# Altium schematic sheet FPGA_E.SchDoc: FIT_PM12 board
size 420 x 297 mm; CheckedBy: G.Kasprowicz; Author: INR Moscow; CompanyName: WUT ISE; DrawnBy: M.Podgórski; Organization: WUT ISE; Address1: PW ISE; Address2: Nowowiejska 15/19 00-665 Warsaw; Address3: gkasprow@gmail.com; DocumentNumber: 27; Revision: 2; SheetNumber: 25; SheetTotal: 34; ModifiedBy: -; CheckedDate: -; Title2: FPGA E LA0,1,2; DivGrp: WUT ISE; Designer: INR RAS; ModifiedDate: -; ProjectName: Sensor Box
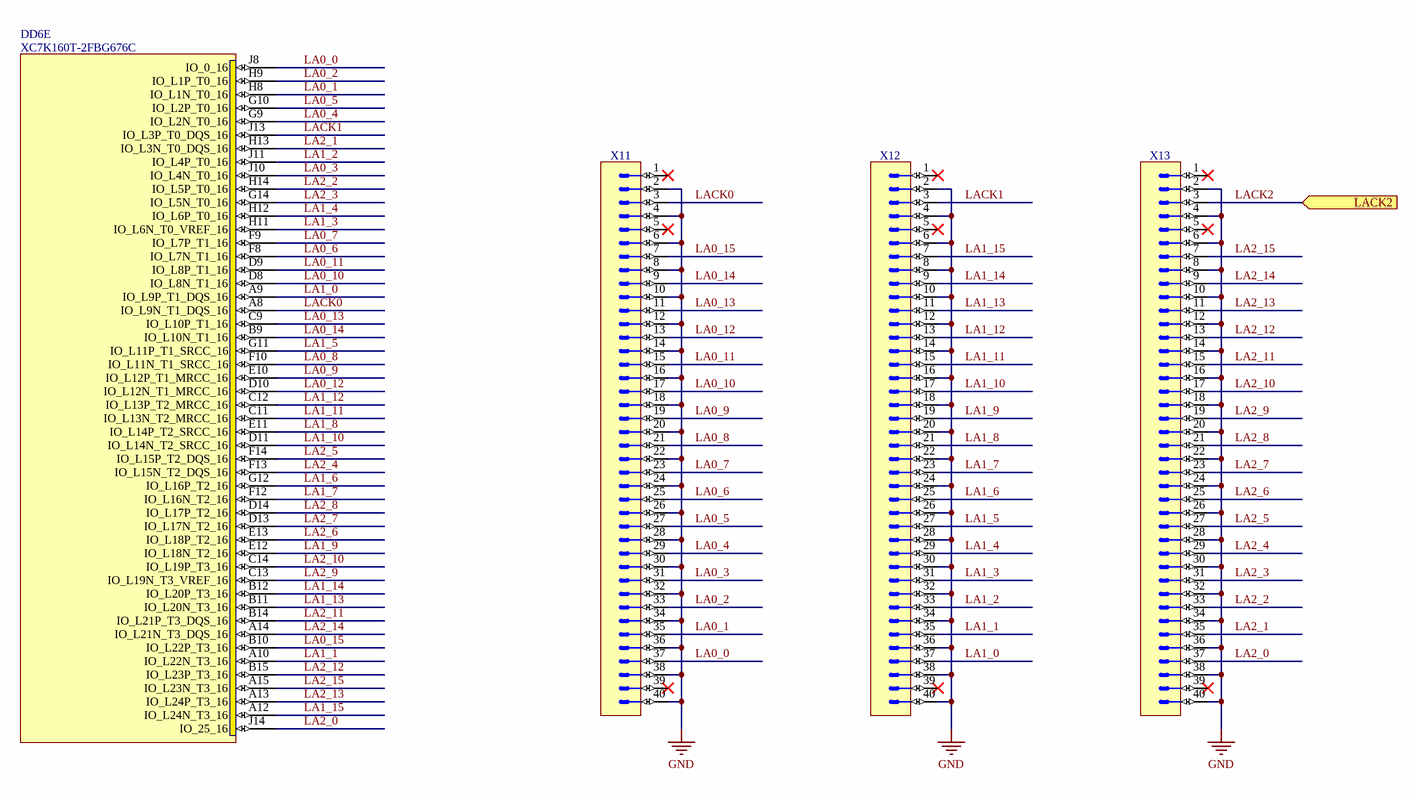
[diagram p0: FPGA_E.SchDoc]

## Parts
DD6  XC7K160T-2FBG676C  [BGA676C100P26X26_2700X2700X254]  (part E of 15)
X11  (no value)  [CONNFLY_DS1013-40SSIB1-B-0]
X12  (no value)  [CONNFLY_DS1013-40SSIB1-B-0]
X13  (no value)  [CONNFLY_DS1013-40SSIB1-B-0]

## Ports
LACK2 (in)

## Nets
GND: X11.2 X11.4 X11.6 X11.8 X11.10 X11.12 X11.14 X11.16 X11.18 X11.20 X11.22 X11.24 X11.26 X11.28 X11.30 X11.32 X11.34 X11.36 X11.38 X11.40 X12.2 X12.4 X12.6 X12.8 X12.10 X12.12 X12.14 X12.16 X12.18 X12.20 X12.22 X12.24 X12.26 X12.28 X12.30 X12.32 X12.34 X12.36 X12.38 X12.40 X13.2 X13.4 X13.6 X13.8 X13.10 X13.12 X13.14 X13.16 X13.18 X13.20 X13.22 X13.24 X13.26 X13.28 X13.30 X13.32 X13.34 X13.36 X13.38 X13.40
LA0_0: DD6.J8(IO_0_16) X11.37
LA0_1: DD6.H8(IO_L1N_T0_16) X11.35
LA0_2: DD6.H9(IO_L1P_T0_16) X11.33
LA0_3: DD6.J10(IO_L4N_T0_16) X11.31
LA0_4: DD6.G9(IO_L2N_T0_16) X11.29
LA0_5: DD6.G10(IO_L2P_T0_16) X11.27
LA0_6: DD6.F8(IO_L7N_T1_16) X11.25
LA0_7: DD6.F9(IO_L7P_T1_16) X11.23
LA0_8: DD6.F10(IO_L11N_T1_SRCC_16) X11.21
LA0_9: DD6.E10(IO_L12P_T1_MRCC_16) X11.19
LA0_10: DD6.D8(IO_L8N_T1_16) X11.17
LA0_11: DD6.D9(IO_L8P_T1_16) X11.15
LA0_12: DD6.D10(IO_L12N_T1_MRCC_16) X11.13
LA0_13: DD6.C9(IO_L10P_T1_16) X11.11
LA0_14: DD6.B9(IO_L10N_T1_16) X11.9
LA0_15: DD6.B10(IO_L22P_T3_16) X11.7
LA1_0: DD6.A9(IO_L9P_T1_DQS_16) X12.37
LA1_1: DD6.A10(IO_L22N_T3_16) X12.35
LA1_2: DD6.J11(IO_L4P_T0_16) X12.33
LA1_3: DD6.H11(IO_L6N_T0_VREF_16) X12.31
LA1_4: DD6.H12(IO_L6P_T0_16) X12.29
LA1_5: DD6.G11(IO_L11P_T1_SRCC_16) X12.27
LA1_6: DD6.G12(IO_L16P_T2_16) X12.25
LA1_7: DD6.F12(IO_L16N_T2_16) X12.23
LA1_8: DD6.E11(IO_L14P_T2_SRCC_16) X12.21
LA1_9: DD6.E12(IO_L18N_T2_16) X12.19
LA1_10: DD6.D11(IO_L14N_T2_SRCC_16) X12.17
LA1_11: DD6.C11(IO_L13N_T2_MRCC_16) X12.15
LA1_12: DD6.C12(IO_L13P_T2_MRCC_16) X12.13
LA1_13: DD6.B11(IO_L20N_T3_16) X12.11
LA1_14: DD6.B12(IO_L20P_T3_16) X12.9
LA1_15: DD6.A12(IO_L24N_T3_16) X12.7
LA2_0: DD6.J14(IO_25_16) X13.37
LA2_1: DD6.H13(IO_L3N_T0_DQS_16) X13.35
LA2_2: DD6.H14(IO_L5P_T0_16) X13.33
LA2_3: DD6.G14(IO_L5N_T0_16) X13.31
LA2_4: DD6.F13(IO_L15N_T2_DQS_16) X13.29
LA2_5: DD6.F14(IO_L15P_T2_DQS_16) X13.27
LA2_6: DD6.E13(IO_L18P_T2_16) X13.25
LA2_7: DD6.D13(IO_L17N_T2_16) X13.23
LA2_8: DD6.D14(IO_L17P_T2_16) X13.21
LA2_9: DD6.C13(IO_L19N_T3_VREF_16) X13.19
LA2_10: DD6.C14(IO_L19P_T3_16) X13.17
LA2_11: DD6.B14(IO_L21P_T3_DQS_16) X13.15
LA2_12: DD6.B15(IO_L23P_T3_16) X13.13
LA2_13: DD6.A13(IO_L24P_T3_16) X13.11
LA2_14: DD6.A14(IO_L21N_T3_DQS_16) X13.9
LA2_15: DD6.A15(IO_L23N_T3_16) X13.7
LACK0: DD6.A8(IO_L9N_T1_DQS_16) X11.3
LACK1: DD6.J13(IO_L3P_T0_DQS_16) X12.3
LACK2: X13.3 ; port LACK2

Not connected (* = marked no-connect by the designer): X11 1* 5* 39*; X12 1* 5* 39*; X13 1* 5* 39*

## Notes on the sheet
- Project/Equipment
- Document
- Designer
- Drawn by
- Check.by
- Copyright WUT ISE 2024.
  This documentation describes Open Hardware and is licensed under the CERN OHL v.2. You may redistribute and modify this documentation under the terms of the CERN OHL v.2. (http://ohwr.org/CERNOHL). This documentation is distributed WITHOUT ANY EXPRESS OR IMPLIED WARRANTY, INCLUDING OF MERCHANTABILITY, SATISFACTORY QUALITY AND FITNESS FOR A PARTICULAR PURPOSE. Please see the CERN OHL v.2 for applicable conditions.
- Contact
- File
- Last Mod.
- Print Date
- Sheet
- Size
- A3
- of
- Rev

## Library data of the parts
DD6 = XC7K160T-2FBG676C: KINTEX-7, FPGA, 676-Ball BGA, Pb-Free; Part Description: KINTEX-7 FPGA, 162240 Logic Cells, 400 User I/O, 8 GTXs, 676-Ball BGA, Speed Grade 2, Commercial Grade, Pb-Free; Manufacturer: XILINX; PressFit: No; Bonding: No; Part Number: XC7K160T-2FBG676C; Component Kind: Standard; Component Type: Standard; Device: XC7K160T-2FBG676C; PackageDescription: BGA, 1.00mm Pitch, Square; 676 Pin, 26 Columns X 26 Rows, Body 27.0mm X 27.0mm X 2.54mm H, IPC Medium Density; Manufacturer Part Number: XC7K160T-2FBG676C; Pin Count: 676; Case: BGA676; Mounted: Yes; Socket: No; SMD: Yes; Sense: No; ComponentHeight: 2.54mm; HelpURL: \\cern.ch\dfs\Applications\Altium\Datasheets\XC7K160T-xFBG676C.pdf; ComponentLink1URL: \\cern.ch\dfs\Applications\Altium\Datasheets\XC7K160T-xFBG676C_Package-Pinout.pdf; ComponentLink1Description: Package/Pinout; Author: CERN DEM BC; CreateDate: 06.02.2020; LatestRevisionDate: 06.02.2020
X11-X13 = CONNFLY_DS1013-40SSIB1-B-0: Connector 40 Male; Part Description: 40 Contacts, 2.54mm Box Header V/T,R/A & SMT Type; PressFit: No; Part Number: CONNFLY_DS1013-40SSIB1-B-0; Component Kind: Standard; Component Type: Standard; Pin Count: 40; Mounted: Yes; Socket: No; SMD: No; Sense: No; Status: None; Manufacturer: CONNFLY; Manufacturer Part Number: DS1013-40SSIB1-B-0; ComponentHeight: 9.1mm; HelpURL: \\cern.ch\dfs\Applications\Altium\Datasheets\CONNFLY_DS1013.pdf; Author: CERN DEM HF; CreateDate: 30.05.2024; LatestRevisionDate: 30.05.2024